# EAGLE schematic Wordclock-back2 (EAGLE 6.0)
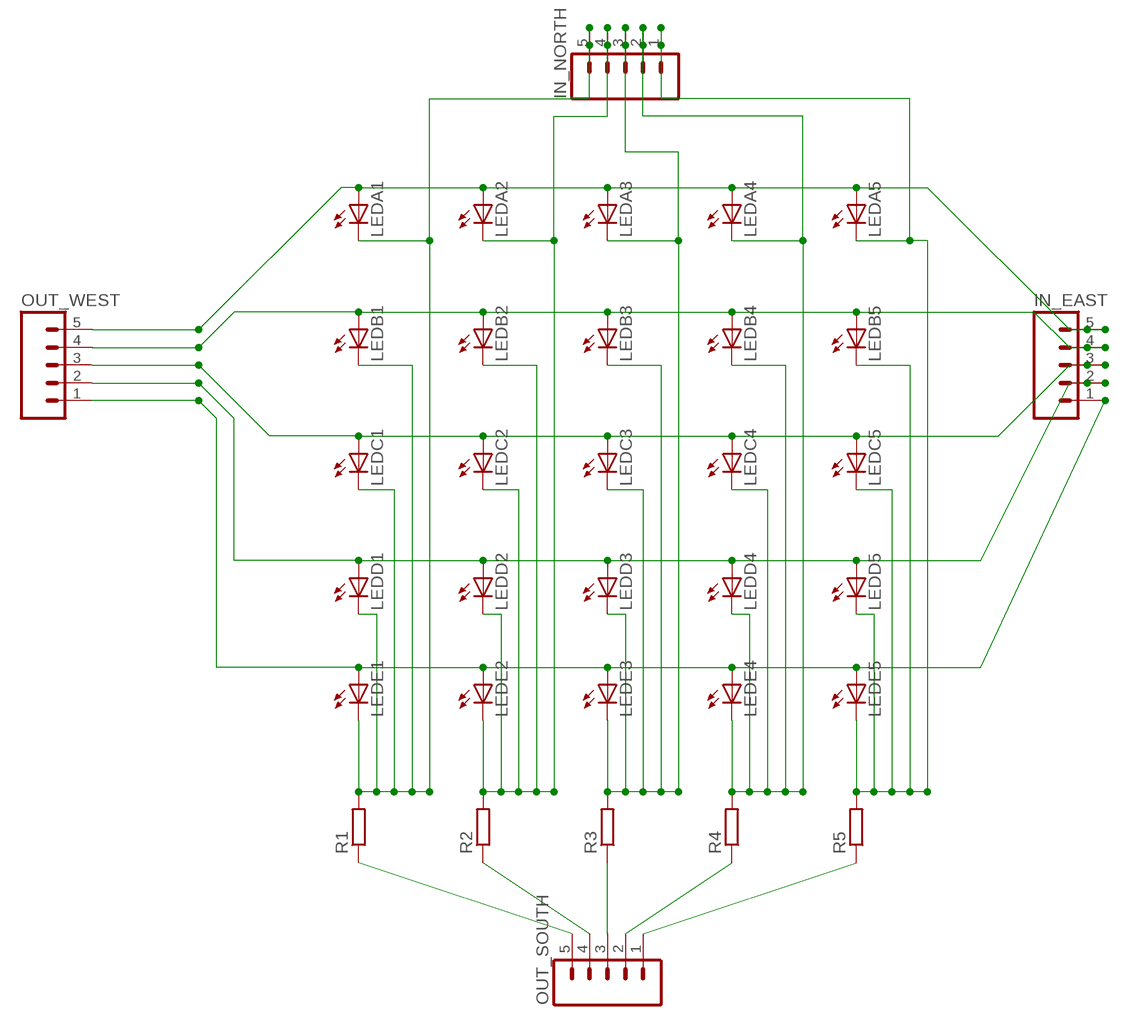
[diagram p0: schematic, sheet 1]

## Parts
IN_EAST  M05PTH  [1X05]
IN_NORTH  M05PTH  [1X05]
LEDA1  LED3MM  [LED3MM]
LEDA2  LED3MM  [LED3MM]
LEDA3  LED3MM  [LED3MM]
LEDA4  LED3MM  [LED3MM]
LEDA5  LED3MM  [LED3MM]
LEDB1  LED3MM  [LED3MM]
LEDB2  LED3MM  [LED3MM]
LEDB3  LED3MM  [LED3MM]
LEDB4  LED3MM  [LED3MM]
LEDB5  LED3MM  [LED3MM]
LEDC1  LED3MM  [LED3MM]
LEDC2  LED3MM  [LED3MM]
LEDC3  LED3MM  [LED3MM]
LEDC4  LED3MM  [LED3MM]
LEDC5  LED3MM  [LED3MM]
LEDD1  LED3MM  [LED3MM]
LEDD2  LED3MM  [LED3MM]
LEDD3  LED3MM  [LED3MM]
LEDD4  LED3MM  [LED3MM]
LEDD5  LED3MM  [LED3MM]
LEDE1  LED3MM  [LED3MM]
LEDE2  LED3MM  [LED3MM]
LEDE3  LED3MM  [LED3MM]
LEDE4  LED3MM  [LED3MM]
LEDE5  LED3MM  [LED3MM]
OUT_SOUTH  M05PTH  [1X05]
OUT_WEST  M05PTH  [1X05]
R1  R-EU_0204/7  [0204/7]
R2  R-EU_0204/7  [0204/7]
R3  R-EU_0204/7  [0204/7]
R4  R-EU_0204/7  [0204/7]
R5  R-EU_0204/7  [0204/7]

## Nets
N$1: IN_NORTH.5 LEDA1.K(C) LEDB1.K(C) LEDC1.K(C) LEDD1.K(C) LEDE1.K(C) R1.2
N$2: IN_NORTH.4 LEDA2.K(C) LEDB2.K(C) LEDC2.K(C) LEDD2.K(C) LEDE2.K(C) R2.2
N$3: IN_NORTH.3 LEDA3.K(C) LEDB3.K(C) LEDC3.K(C) LEDD3.K(C) LEDE3.K(C) R3.2
N$4: IN_NORTH.2 LEDA4.K(C) LEDB4.K(C) LEDC4.K(C) LEDD4.K(C) LEDE4.K(C) R4.2
N$5: IN_NORTH.1 LEDA5.K(C) LEDB5.K(C) LEDC5.K(C) LEDD5.K(C) LEDE5.K(C) R5.2
N$6: OUT_SOUTH.1 R5.1
N$12: OUT_SOUTH.2 R4.1
N$13: OUT_SOUTH.3 R3.1
N$14: OUT_SOUTH.4 R2.1
N$15: OUT_SOUTH.5 R1.1
N$16: IN_EAST.5 LEDA1.A LEDA2.A LEDA3.A LEDA4.A LEDA5.A OUT_WEST.5
N$17: IN_EAST.4 LEDB1.A LEDB2.A LEDB3.A LEDB4.A LEDB5.A OUT_WEST.4
N$18: IN_EAST.3 LEDC1.A LEDC2.A LEDC3.A LEDC4.A LEDC5.A OUT_WEST.3
N$19: IN_EAST.2 LEDD1.A LEDD2.A LEDD3.A LEDD4.A LEDD5.A OUT_WEST.2
N$20: IN_EAST.1 LEDE1.A LEDE2.A LEDE3.A LEDE4.A LEDE5.A OUT_WEST.1

## Library data of the parts
IN_EAST IN_NORTH OUT_SOUTH OUT_WEST = SparkFun:M05: Header 5 Standard 5-pin 0.1" header. Use with straight break away headers (SKU : PRT-00116), right angle break away headers (PRT-00553), swiss pins (PRT-00743), machine pins (PRT-00117), and female headers (PRT-00115). Molex polarized connector foot print use with SKU : PRT-08230 with associated crimp pins and housings.
LEDA1-LEDA5 LEDB1-LEDB5 LEDC1-LEDC5 LEDD1-LEDD5 LEDE1-LEDE5 = led:LED: LED OSRAM: - CHIPLED LG R971, LG N971, LY N971, LG Q971, LY Q971, LO R971, LY R971 LH N974, LH R974 LS Q976, LO Q976, LY Q976 LO Q996 - Hyper CHIPLED LW Q18S LB Q993, LB Q99A, LB R99A - SideLED LS A670, LO A670, LY A670, LG A670, LP A670 LB A673, LV A673, LT A673, LW A673 LH A674 LY A675 LS A676, LA A676, LO A676, LY A676, LW A676 LS A679, LY A679, LG A679 - Hyper Micro SIDELED® LS Y876, LA Y876, LO Y876, LY Y876 LT Y87S - SmartLED LW L88C, LW L88S LB L89C, LB L89S, LG L890 LS L89K, LO L89K, LY L89K LS L896, LA L896, LO L896, LY L896 - TOPLED LS T670, LO T670, LY T670, LG T670, LP T670 LSG T670, LSP T670, LSY T670, LOP T670, LYG T670 LG T671, LOG T671, LSG T671 LB T673, LV T673, LT T673, LW T673 LH T674 LS T676, LA T676, LO T676, LY T676, LB T676, LH T676, LSB T676, LW T676 LB T67C, LV T67C, LT T67C, LS T67K, LO T67K, LY T67K, LW E67C LS E67B, LA E67B, LO E67B, LY E67B, LB E67C, LV E67C, LT E67C LW T67C LS T679, LY T679, LG T679 LS T770, LO T770, LY T770, LG T770, LP T770 LB T773, LV T773, LT T773, LW T773 LH T774 LS E675, LA E675, LY E675, LS T675 LS T776, LA T776, LO T776, LY T776, LB T776 LHGB T686 LT T68C, LB T68C - Hyper Mini TOPLED® LB M676 - Mini TOPLED Santana® LG M470 LS M47K, LO M47K, LY M47K Source: http://www.osram.convergy.de LUXEON: - LUMILED® LXK2-PW12-R00, LXK2-PW12-S00, LXK2-PW14-U00, LXK2-PW14-V00 LXK2-PM12-R00, LXK2-PM12-S00, LXK2-PM14-U00 LXK2-PE12-Q00, LXK2-PE12-R00, LXK2-PE12-S00, LXK2-PE14-T00, LXK2-PE14-U00 LXK2-PB12-K00, LXK2-PB12-L00, LXK2-PB12-M00, LXK2-PB14-N00, LXK2-PB14-P00, LXK2-PB14-Q00 LXK2-PR12-L00, LXK2-PR12-M00, LXK2-PR14-Q00, LXK2-PR14-R00 LXK2-PD12-Q00, LXK2-PD12-R00, LXK2-PD12-S00 LXK2-PH12-R00, LXK2-PH12-S00 LXK2-PL12-P00, LXK2-PL12-Q00, LXK2-PL12-R00 Source: www.luxeon.com KINGBRIGHT: KA-3528ASYC Source: www.kingbright.com
R1-R5 = resistor:R-EU_: RESISTOR, European symbol